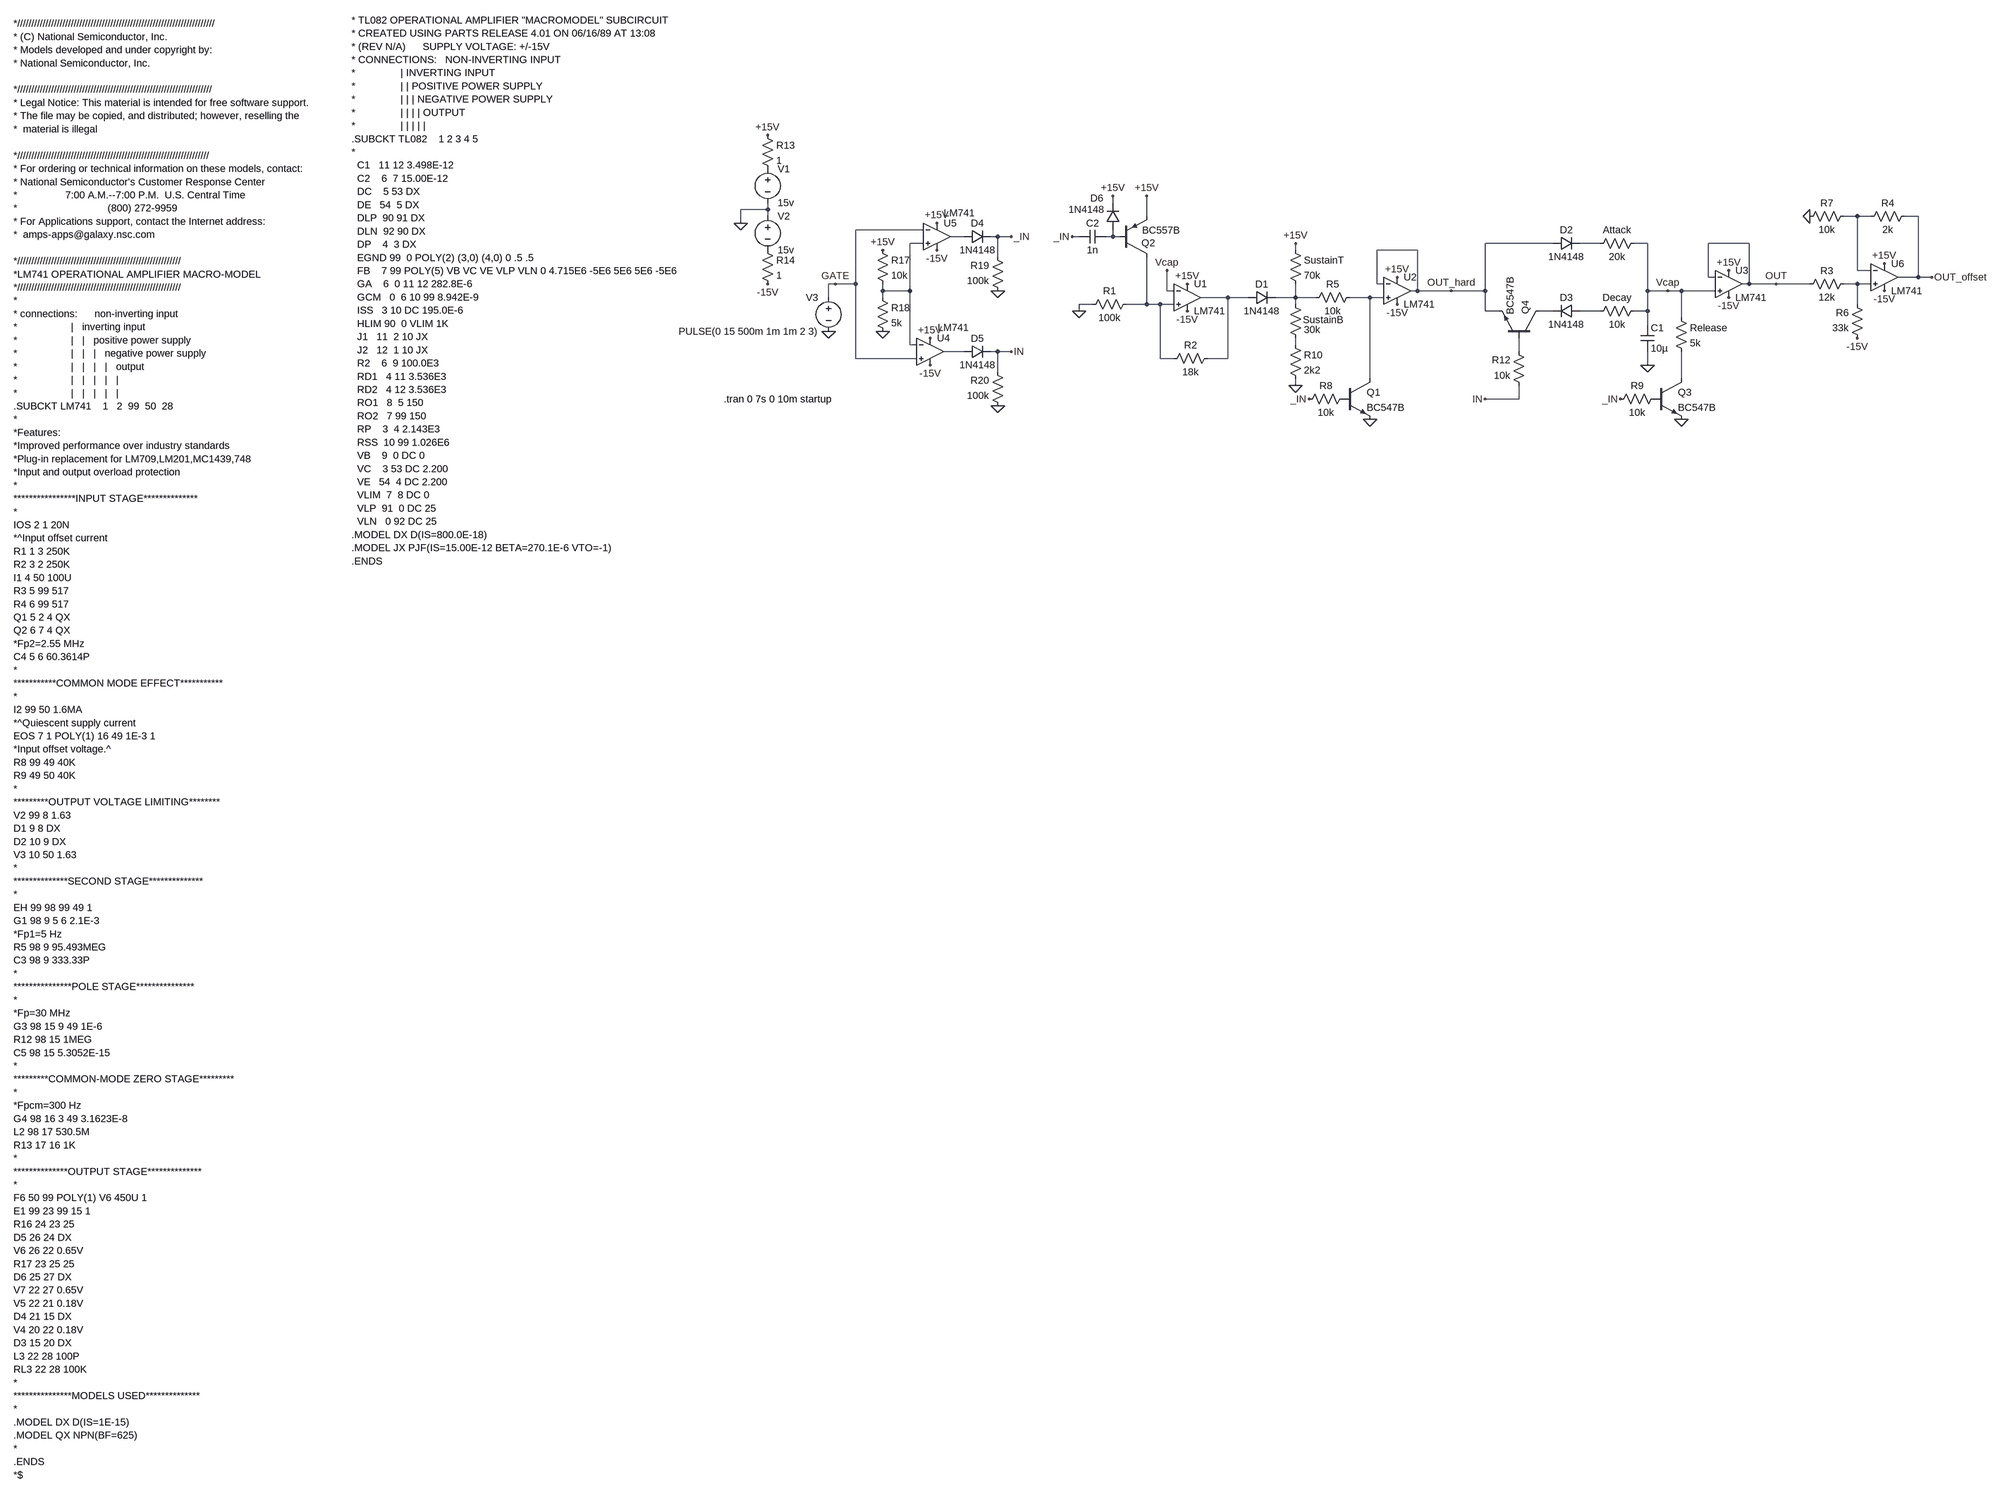
[diagram p0: schematic ADSR.asc]
ADSR.asc, the LTspice schematic file:
Version 4
SHEET 1 2688 2848
WIRE 128 176 128 160
WIRE -688 192 -688 176
WIRE -688 192 -752 192
WIRE -688 208 -688 192
WIRE 208 208 208 160
WIRE 1888 208 1856 208
WIRE 1920 208 1888 208
WIRE 2032 208 2000 208
WIRE -752 224 -752 192
WIRE -320 240 -480 240
WIRE -224 256 -256 256
WIRE -144 256 -160 256
WIRE -112 256 -144 256
WIRE 48 256 32 256
WIRE 128 256 128 240
WIRE 128 256 112 256
WIRE 144 256 128 256
WIRE -320 272 -352 272
WIRE 1168 272 1008 272
WIRE 1280 272 1232 272
WIRE 1392 272 1360 272
WIRE 1632 272 1536 272
WIRE 560 288 560 272
WIRE 848 288 752 288
WIRE -144 304 -144 256
WIRE 1888 336 1888 208
WIRE 1920 336 1888 336
WIRE 1536 352 1536 272
WIRE 1552 352 1536 352
WIRE 2032 352 2032 208
WIRE 2032 352 1984 352
WIRE 2064 352 2032 352
WIRE -528 368 -544 368
WIRE -480 368 -480 240
WIRE -480 368 -528 368
WIRE 752 368 752 288
WIRE 768 368 752 368
WIRE 1632 368 1632 272
WIRE 1632 368 1616 368
WIRE 1696 368 1632 368
WIRE 1776 368 1696 368
WIRE 1888 368 1856 368
WIRE 1920 368 1888 368
WIRE -416 384 -416 368
WIRE -352 384 -352 272
WIRE -352 384 -416 384
WIRE 256 384 256 336
WIRE 272 384 256 384
WIRE 848 384 848 288
WIRE 848 384 832 384
WIRE 928 384 848 384
WIRE 1008 384 1008 272
WIRE 1008 384 928 384
WIRE 1392 384 1392 272
WIRE 1440 384 1392 384
WIRE 1472 384 1440 384
WIRE 1552 384 1472 384
WIRE -544 400 -544 368
WIRE -416 400 -416 384
WIRE 400 400 336 400
WIRE 448 400 400 400
WIRE 560 400 560 368
WIRE 560 400 512 400
WIRE 608 400 560 400
WIRE 736 400 688 400
WIRE 768 400 736 400
WIRE 80 416 48 416
WIRE 208 416 208 304
WIRE 208 416 160 416
WIRE 240 416 208 416
WIRE 272 416 240 416
WIRE 560 416 560 400
WIRE 1888 416 1888 368
WIRE 48 432 48 416
WIRE 1008 432 1008 384
WIRE 1040 432 1008 432
WIRE 1168 432 1136 432
WIRE 1280 432 1232 432
WIRE 1392 432 1392 384
WIRE 1392 432 1360 432
WIRE 1472 448 1472 384
WIRE 1392 464 1392 432
WIRE -352 512 -352 384
WIRE -336 512 -352 512
WIRE 560 512 560 496
WIRE -224 528 -272 528
WIRE -144 528 -160 528
WIRE -112 528 -144 528
WIRE 1088 528 1088 496
WIRE -480 544 -480 368
WIRE -336 544 -480 544
WIRE 240 544 240 416
WIRE 272 544 240 544
WIRE 400 544 400 400
WIRE 400 544 352 544
WIRE 1392 560 1392 528
WIRE -144 576 -144 528
WIRE 736 592 736 400
WIRE 1472 592 1472 528
WIRE 560 608 560 592
WIRE 1088 640 1088 608
WIRE 1088 640 1008 640
FLAG -752 224 0
FLAG -688 16 +15V
FLAG -688 368 -15V
FLAG -544 480 0
FLAG -112 528 IN
FLAG 304 432 -15V
FLAG 304 368 +15V
FLAG 48 432 0
FLAG 560 608 0
FLAG 560 272 +15V
FLAG 736 688 0
FLAG 800 416 -15V
FLAG 800 352 +15V
FLAG 1392 560 0
FLAG 1584 400 -15V
FLAG 1584 336 +15V
FLAG 592 640 _IN
FLAG 1472 688 0
FLAG 1328 640 _IN
FLAG 1696 368 OUT
FLAG 1440 384 Vcap
FLAG 256 336 Vcap
FLAG 208 160 +15V
FLAG 1008 640 IN
FLAG 928 384 OUT_hard
FLAG -304 560 -15V
FLAG -304 496 +15V
FLAG -288 288 -15V
FLAG -288 224 +15V
FLAG -112 256 _IN
FLAG -416 480 0
FLAG -416 288 +15V
FLAG -144 384 0
FLAG -144 656 0
FLAG 128 160 +15V
FLAG 32 256 _IN
FLAG -528 368 GATE
FLAG 1952 384 -15V
FLAG 1952 320 +15V
FLAG 2064 352 OUT_offset
FLAG 1888 496 -15V
FLAG 1776 208 0
SYMBOL Opamps\\opamp2 304 336 R0
SYMATTR InstName U1
SYMATTR Value LM741
SYMBOL voltage -688 80 R0
SYMATTR InstName V1
SYMATTR Value 15v
SYMBOL voltage -688 192 R0
SYMATTR InstName V2
SYMATTR Value 15v
SYMBOL voltage -544 384 M0
WINDOW 123 0 0 Left 0
WINDOW 39 0 0 Left 0
SYMATTR InstName V3
SYMATTR Value PULSE(0 15 500m 1m 1m 2 3)
SYMBOL npn 672 592 R0
SYMATTR InstName Q1
SYMATTR Value BC547B
SYMBOL pnp 144 304 M180
WINDOW 0 52 33 Left 2
WINDOW 3 53 63 Left 2
SYMATTR InstName Q2
SYMATTR Value BC557B
SYMBOL res 176 400 R90
WINDOW 0 0 56 VBottom 2
WINDOW 3 32 56 VTop 2
SYMATTR InstName R1
SYMATTR Value 100k
SYMBOL res 368 528 R90
WINDOW 0 0 56 VBottom 2
WINDOW 3 32 56 VTop 2
SYMATTR InstName R2
SYMATTR Value 18k
SYMBOL diode 448 416 R270
WINDOW 0 32 32 VTop 2
WINDOW 3 0 32 VBottom 2
SYMATTR InstName D1
SYMATTR Value 1N4148
SYMBOL res 544 272 R0
SYMATTR InstName SustainT
SYMATTR Value 70k
SYMBOL res 544 400 R0
WINDOW 0 33 53 Left 2
SYMATTR InstName SustainB
SYMATTR Value 30k
SYMBOL res 704 384 R90
WINDOW 0 0 56 VBottom 2
WINDOW 3 32 56 VTop 2
SYMATTR InstName R5
SYMATTR Value 10k
SYMBOL Opamps\\opamp2 800 320 R0
SYMATTR InstName U2
SYMATTR Value LM741
SYMBOL diode 1168 288 R270
WINDOW 0 32 32 VTop 2
WINDOW 3 0 32 VBottom 2
SYMATTR InstName D2
SYMATTR Value 1N4148
SYMBOL diode 1232 416 R90
WINDOW 0 0 32 VBottom 2
WINDOW 3 32 32 VTop 2
SYMATTR InstName D3
SYMATTR Value 1N4148
SYMBOL res 1376 256 R90
WINDOW 0 0 56 VBottom 2
WINDOW 3 32 56 VTop 2
SYMATTR InstName Attack
SYMATTR Value 20k
SYMBOL res 1376 416 R90
WINDOW 0 0 56 VBottom 2
WINDOW 3 32 56 VTop 2
SYMATTR InstName Decay
SYMATTR Value 10k
SYMBOL cap 1376 464 R0
SYMATTR InstName C1
SYMATTR Value 10µ
SYMBOL Opamps\\opamp2 1584 304 R0
SYMATTR InstName U3
SYMATTR Value LM741
SYMBOL res 688 624 R90
WINDOW 0 0 56 VBottom 2
WINDOW 3 32 56 VTop 2
SYMATTR InstName R8
SYMATTR Value 10k
SYMBOL npn 1408 592 R0
SYMATTR InstName Q3
SYMATTR Value BC547B
SYMBOL res 1424 624 R90
WINDOW 0 0 56 VBottom 2
WINDOW 3 32 56 VTop 2
SYMATTR InstName R9
SYMATTR Value 10k
SYMBOL res 1456 432 R0
SYMATTR InstName Release
SYMATTR Value 5k
SYMBOL npn 1136 496 M270
SYMATTR InstName Q4
SYMATTR Value BC547B
SYMBOL res 1104 624 R180
WINDOW 0 36 76 Left 2
WINDOW 3 36 40 Left 2
SYMATTR InstName R12
SYMATTR Value 10k
SYMBOL res -704 0 R0
SYMATTR InstName R13
SYMATTR Value 1
SYMBOL res -704 272 R0
SYMATTR InstName R14
SYMATTR Value 1
SYMBOL Opamps\\opamp2 -304 464 R0
WINDOW 3 18 7 Left 2
SYMATTR Value LM741
SYMATTR InstName U4
SYMBOL Opamps\\opamp2 -288 192 R0
WINDOW 3 16 8 Left 2
SYMATTR Value LM741
SYMATTR InstName U5
SYMBOL res -432 272 R0
SYMATTR InstName R17
SYMATTR Value 10k
SYMBOL res -432 384 R0
SYMATTR InstName R18
SYMATTR Value 5k
SYMBOL diode -224 272 R270
WINDOW 0 32 32 VTop 2
WINDOW 3 0 32 VBottom 2
SYMATTR InstName D4
SYMATTR Value 1N4148
SYMBOL res -128 400 R180
WINDOW 0 36 76 Left 2
WINDOW 3 36 40 Left 2
SYMATTR InstName R19
SYMATTR Value 100k
SYMBOL diode -224 544 R270
WINDOW 0 32 32 VTop 2
WINDOW 3 0 32 VBottom 2
SYMATTR InstName D5
SYMATTR Value 1N4148
SYMBOL res -128 672 R180
WINDOW 0 36 76 Left 2
WINDOW 3 36 40 Left 2
SYMATTR InstName R20
SYMATTR Value 100k
SYMBOL cap 112 240 R90
WINDOW 0 0 32 VBottom 2
WINDOW 3 32 32 VTop 2
SYMATTR InstName C2
SYMATTR Value 1n
SYMBOL diode 144 240 R180
WINDOW 0 38 75 Left 2
WINDOW 3 36 48 Left 2
SYMATTR InstName D6
SYMATTR Value 1N4148
SYMBOL Opamps\\opamp2 1952 288 R0
SYMATTR InstName U6
SYMATTR Value LM741
SYMBOL res 1872 352 R90
WINDOW 0 0 56 VBottom 2
WINDOW 3 32 56 VTop 2
SYMATTR InstName R3
SYMATTR Value 12k
SYMBOL res 1904 512 R180
WINDOW 0 36 76 Left 2
WINDOW 3 36 40 Left 2
SYMATTR InstName R6
SYMATTR Value 33k
SYMBOL res 2016 192 R90
WINDOW 0 0 56 VBottom 2
WINDOW 3 32 56 VTop 2
SYMATTR InstName R4
SYMATTR Value 2k
SYMBOL res 1872 192 R90
WINDOW 0 0 56 VBottom 2
WINDOW 3 32 56 VTop 2
SYMATTR InstName R7
SYMATTR Value 10k
SYMBOL res 544 496 R0
SYMATTR InstName R10
SYMATTR Value 2k2
TEXT -1672 -256 Left 2 !* TL082 OPERATIONAL AMPLIFIER "MACROMODEL" SUBCIRCUIT\n* CREATED USING PARTS RELEASE 4.01 ON 06/16/89 AT 13:08\n* (REV N/A)      SUPPLY VOLTAGE: +/-15V\n* CONNECTIONS:   NON-INVERTING INPUT\n*                | INVERTING INPUT\n*                | | POSITIVE POWER SUPPLY\n*                | | | NEGATIVE POWER SUPPLY\n*                | | | | OUTPUT\n*                | | | | |\n.SUBCKT TL082    1 2 3 4 5\n*\n  C1   11 12 3.498E-12\n  C2    6  7 15.00E-12\n  DC    5 53 DX\n  DE   54  5 DX\n  DLP  90 91 DX\n  DLN  92 90 DX\n  DP    4  3 DX\n  EGND 99  0 POLY(2) (3,0) (4,0) 0 .5 .5\n  FB    7 99 POLY(5) VB VC VE VLP VLN 0 4.715E6 -5E6 5E6 5E6 -5E6\n  GA    6  0 11 12 282.8E-6\n  GCM   0  6 10 99 8.942E-9\n  ISS   3 10 DC 195.0E-6\n  HLIM 90  0 VLIM 1K\n  J1   11  2 10 JX\n  J2   12  1 10 JX\n  R2    6  9 100.0E3\n  RD1   4 11 3.536E3\n  RD2   4 12 3.536E3\n  RO1   8  5 150\n  RO2   7 99 150\n  RP    3  4 2.143E3\n  RSS  10 99 1.026E6\n  VB    9  0 DC 0\n  VC    3 53 DC 2.200\n  VE   54  4 DC 2.200\n  VLIM  7  8 DC 0\n  VLP  91  0 DC 25\n  VLN   0 92 DC 25\n.MODEL DX D(IS=800.0E-18)\n.MODEL JX PJF(IS=15.00E-12 BETA=270.1E-6 VTO=-1)\n.ENDS
TEXT -792 640 Left 2 !.tran 0 7s 0 10m startup
TEXT -2496 -248 Left 2 !*//////////////////////////////////////////////////////////////////////\n* (C) National Semiconductor, Inc.\n* Models developed and under copyright by:\n* National Semiconductor, Inc.  \n \n*/////////////////////////////////////////////////////////////////////\n* Legal Notice: This material is intended for free software support.\n* The file may be copied, and distributed; however, reselling the \n*  material is illegal\n \n*////////////////////////////////////////////////////////////////////\n* For ordering or technical information on these models, contact:\n* National Semiconductor's Customer Response Center\n*                 7:00 A.M.--7:00 P.M.  U.S. Central Time\n*                                (800) 272-9959\n* For Applications support, contact the Internet address:\n*  amps-apps@galaxy.nsc.com\n \n*//////////////////////////////////////////////////////////\n*LM741 OPERATIONAL AMPLIFIER MACRO-MODEL\n*//////////////////////////////////////////////////////////\n*\n* connections:      non-inverting input\n*                   |   inverting input\n*                   |   |   positive power supply\n*                   |   |   |   negative power supply\n*                   |   |   |   |   output\n*                   |   |   |   |   |\n*                   |   |   |   |   |\n.SUBCKT LM741    1   2  99  50  28\n*\n*Features:\n*Improved performance over industry standards\n*Plug-in replacement for LM709,LM201,MC1439,748\n*Input and output overload protection\n*\n****************INPUT STAGE**************\n*\nIOS 2 1 20N\n*^Input offset current\nR1 1 3 250K\nR2 3 2 250K\nI1 4 50 100U\nR3 5 99 517\nR4 6 99 517\nQ1 5 2 4 QX\nQ2 6 7 4 QX\n*Fp2=2.55 MHz\nC4 5 6 60.3614P\n*\n***********COMMON MODE EFFECT***********\n*\nI2 99 50 1.6MA\n*^Quiescent supply current\nEOS 7 1 POLY(1) 16 49 1E-3 1\n*Input offset voltage.^\nR8 99 49 40K\nR9 49 50 40K\n*\n*********OUTPUT VOLTAGE LIMITING********\nV2 99 8 1.63\nD1 9 8 DX\nD2 10 9 DX\nV3 10 50 1.63\n*\n**************SECOND STAGE**************\n*\nEH 99 98 99 49 1\nG1 98 9 5 6 2.1E-3\n*Fp1=5 Hz\nR5 98 9 95.493MEG\nC3 98 9 333.33P\n*\n***************POLE STAGE***************\n*\n*Fp=30 MHz\nG3 98 15 9 49 1E-6\nR12 98 15 1MEG\nC5 98 15 5.3052E-15\n*\n*********COMMON-MODE ZERO STAGE*********\n*\n*Fpcm=300 Hz\nG4 98 16 3 49 3.1623E-8\nL2 98 17 530.5M\nR13 17 16 1K\n*\n**************OUTPUT STAGE**************\n*\nF6 50 99 POLY(1) V6 450U 1\nE1 99 23 99 15 1\nR16 24 23 25\nD5 26 24 DX\nV6 26 22 0.65V\nR17 23 25 25\nD6 25 27 DX\nV7 22 27 0.65V\nV5 22 21 0.18V\nD4 21 15 DX\nV4 20 22 0.18V\nD3 15 20 DX\nL3 22 28 100P\nRL3 22 28 100K\n*\n***************MODELS USED**************\n*\n.MODEL DX D(IS=1E-15)\n.MODEL QX NPN(BF=625)\n*\n.ENDS\n*$

The netlist it stands for:
* ADSR.asc
XU1 N010 Vcap +15V -15V N007 LM741  ; pins In+ In- V+ V- OUT
V1 P001 0 15v
V2 0 P002 15v
V3 GATE 0 PULSE(0 15 500m 1m 1m 2 3)
Q1 N009 P003 0 0 BC547B
Q2 N010 N003 +15V 0 BC557B
R1 N010 0 100k
R2 N007 N010 18k
D1 N007 N008 1N4148
R§SustainT +15V N008 70k
R§SustainB N008 N013 30k
R5 N009 N008 10k
XU2 N009 OUT_hard +15V -15V OUT_hard LM741  ; pins In+ In- V+ V- OUT
D2 OUT_hard N005 1N4148
D3 N012 N011 1N4148
R§Attack Vcap N005 20k
R§Decay Vcap N012 10k
C1 Vcap 0 10µ
XU3 Vcap OUT +15V -15V OUT LM741  ; pins In+ In- V+ V- OUT
R8 P003 _IN 10k
Q3 N016 P004 0 0 BC547B
R9 P004 _IN 10k
Release Vcap N016 5k
Q4 N011 N015 OUT_hard 0 BC547B
R12 IN N015 10k
R13 +15V P001 1
R14 P002 -15V 1
XU4 GATE N004 +15V -15V N014 LM741  ; pins In+ In- V+ V- OUT
XU5 N004 GATE +15V -15V N002 LM741  ; pins In+ In- V+ V- OUT
R17 +15V N004 10k
R18 N004 0 5k
D4 N002 _IN 1N4148
R19 0 _IN 100k
D5 N014 IN 1N4148
R20 0 IN 100k
C2 N003 _IN 1n
D6 N003 +15V 1N4148
XU6 N006 N001 +15V -15V OUT_offset LM741  ; pins In+ In- V+ V- OUT
R3 N006 OUT 12k
R6 -15V N006 33k
R4 OUT_offset N001 2k
R7 N001 0 10k
R10 N013 0 2k2
.model D D
.lib standard.dio
.model NPN NPN
.model PNP PNP
.lib standard.bjt
* TL082 OPERATIONAL AMPLIFIER "MACROMODEL" SUBCIRCUIT
* CREATED USING PARTS RELEASE 4.01 ON 06/16/89 AT 13:08
* (REV N/A)      SUPPLY VOLTAGE: +/-15V
* CONNECTIONS:   NON-INVERTING INPUT
*                | INVERTING INPUT
*                | | POSITIVE POWER SUPPLY
*                | | | NEGATIVE POWER SUPPLY
*                | | | | OUTPUT
*                | | | | |
.SUBCKT TL082    1 2 3 4 5
*
  C1   11 12 3.498E-12
  C2    6  7 15.00E-12
  DC    5 53 DX
  DE   54  5 DX
  DLP  90 91 DX
  DLN  92 90 DX
  DP    4  3 DX
  EGND 99  0 POLY(2) (3,0) (4,0) 0 .5 .5
  FB    7 99 POLY(5) VB VC VE VLP VLN 0 4.715E6 -5E6 5E6 5E6 -5E6
  GA    6  0 11 12 282.8E-6
  GCM   0  6 10 99 8.942E-9
  ISS   3 10 DC 195.0E-6
  HLIM 90  0 VLIM 1K
  J1   11  2 10 JX
  J2   12  1 10 JX
  R2    6  9 100.0E3
  RD1   4 11 3.536E3
  RD2   4 12 3.536E3
  RO1   8  5 150
  RO2   7 99 150
  RP    3  4 2.143E3
  RSS  10 99 1.026E6
  VB    9  0 DC 0
  VC    3 53 DC 2.200
  VE   54  4 DC 2.200
  VLIM  7  8 DC 0
  VLP  91  0 DC 25
  VLN   0 92 DC 25
.MODEL DX D(IS=800.0E-18)
.MODEL JX PJF(IS=15.00E-12 BETA=270.1E-6 VTO=-1)
.ENDS
.tran 0 7s 0 10m startup
*//////////////////////////////////////////////////////////////////////
* (C) National Semiconductor, Inc.
* Models developed and under copyright by:
* National Semiconductor, Inc.
*/////////////////////////////////////////////////////////////////////
* Legal Notice: This material is intended for free software support.
* The file may be copied, and distributed; however, reselling the
*  material is illegal
*////////////////////////////////////////////////////////////////////
* For ordering or technical information on these models, contact:
* National Semiconductor's Customer Response Center
*                 7:00 A.M.--7:00 P.M.  U.S. Central Time
*                                (800) 272-9959
* For Applications support, contact the Internet address:
*  amps-apps@galaxy.nsc.com
*//////////////////////////////////////////////////////////
*LM741 OPERATIONAL AMPLIFIER MACRO-MODEL
*//////////////////////////////////////////////////////////
*
* connections:      non-inverting input
*                   |   inverting input
*                   |   |   positive power supply
*                   |   |   |   negative power supply
*                   |   |   |   |   output
*                   |   |   |   |   |
*                   |   |   |   |   |
.SUBCKT LM741    1   2  99  50  28
*
*Features:
*Improved performance over industry standards
*Plug-in replacement for LM709,LM201,MC1439,748
*Input and output overload protection
*
****************INPUT STAGE**************
*
IOS 2 1 20N
*^Input offset current
R1 1 3 250K
R2 3 2 250K
I1 4 50 100U
R3 5 99 517
R4 6 99 517
Q1 5 2 4 QX
Q2 6 7 4 QX
*Fp2=2.55 MHz
C4 5 6 60.3614P
*
***********COMMON MODE EFFECT***********
*
I2 99 50 1.6MA
*^Quiescent supply current
EOS 7 1 POLY(1) 16 49 1E-3 1
*Input offset voltage.^
R8 99 49 40K
R9 49 50 40K
*
*********OUTPUT VOLTAGE LIMITING********
V2 99 8 1.63
D1 9 8 DX
D2 10 9 DX
V3 10 50 1.63
*
**************SECOND STAGE**************
*
EH 99 98 99 49 1
G1 98 9 5 6 2.1E-3
*Fp1=5 Hz
R5 98 9 95.493MEG
C3 98 9 333.33P
*
***************POLE STAGE***************
*
*Fp=30 MHz
G3 98 15 9 49 1E-6
R12 98 15 1MEG
C5 98 15 5.3052E-15
*
*********COMMON-MODE ZERO STAGE*********
*
*Fpcm=300 Hz
G4 98 16 3 49 3.1623E-8
L2 98 17 530.5M
R13 17 16 1K
*
**************OUTPUT STAGE**************
*
F6 50 99 POLY(1) V6 450U 1
E1 99 23 99 15 1
R16 24 23 25
D5 26 24 DX
V6 26 22 0.65V
R17 23 25 25
D6 25 27 DX
V7 22 27 0.65V
V5 22 21 0.18V
D4 21 15 DX
V4 20 22 0.18V
D3 15 20 DX
L3 22 28 100P
RL3 22 28 100K
*
***************MODELS USED**************
*
.MODEL DX D(IS=1E-15)
.MODEL QX NPN(BF=625)
*
.ENDS
*$
.backanno
.end